# EAGLE schematic Encoder Board Schematic (EAGLE 9.7.0)
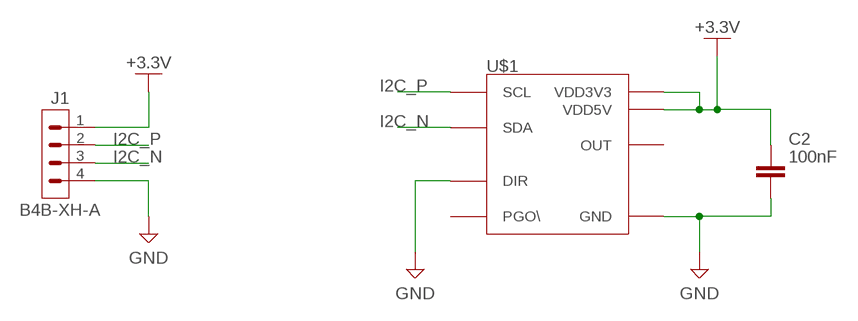
[diagram p0: schematic, sheet 1]

## Parts
C2  100nF  C_CHIP-0805(2012-METRIC)  [CAPC2012X110]
J1  B4B-XH-A  [B4B-XH-A]
U$1  AS5600  [AS5600]

## Nets
+3.3V: C2.1 J1.1 U$1.1(VDD5V) U$1.2(VDD3V3)
GND: C2.2 J1.4 U$1.4(GND) U$1.8(DIR)
I2C_N: J1.3 U$1.6(SDA)
I2C_P: J1.2 U$1.7(SCL)
Unconnected: U$1.3(OUT) U$1.5(PGO\)

## Library data of the parts
C2 = Capacitor:C: Capacitor - Generic; CATEGORY: Capacitor; PACKAGE_SIZE: 0805; PACKAGE_TYPE: SMD; SUBCATEGORY: Ceramic Capacitors; TYPE: MLCC
J1 = Connector:B4B-XH-A: XH Connector Top Entry - 4POS Reference: Datasheet <http://www.jst-mfg.com/product/pdf/eng/eXH.pdf>; CATEGORY: Connectors; DATASHEET: https://www.jst-mfg.com/product/pdf/eng/eXH.pdf; DESCRIPTION: Connector Header Through Hole 4 position 0.098" (2.50mm); MANUFACTURER: JST Sales America Inc.; MPN: B4B-XH-A; OPERATING_TEMPERATURE: -25°C ~ 85°C; PACKAGE_SIZE: NA; PACKAGE_TYPE: Through Hole; PART_STATUS: Active; PITCH: 0.098" (2.50mm); ROHS: Compliant; SERIES: XH; SUBCATEGORY: Rectangular Connectors; TYPE: Male Headers
U$1 = CohenLibrary:AS5600: https://www.digikey.com/en/products/detail/ams-osram-usa-inc/AS5600-ASOM-SOIC8-LF-T-RDP/4914332